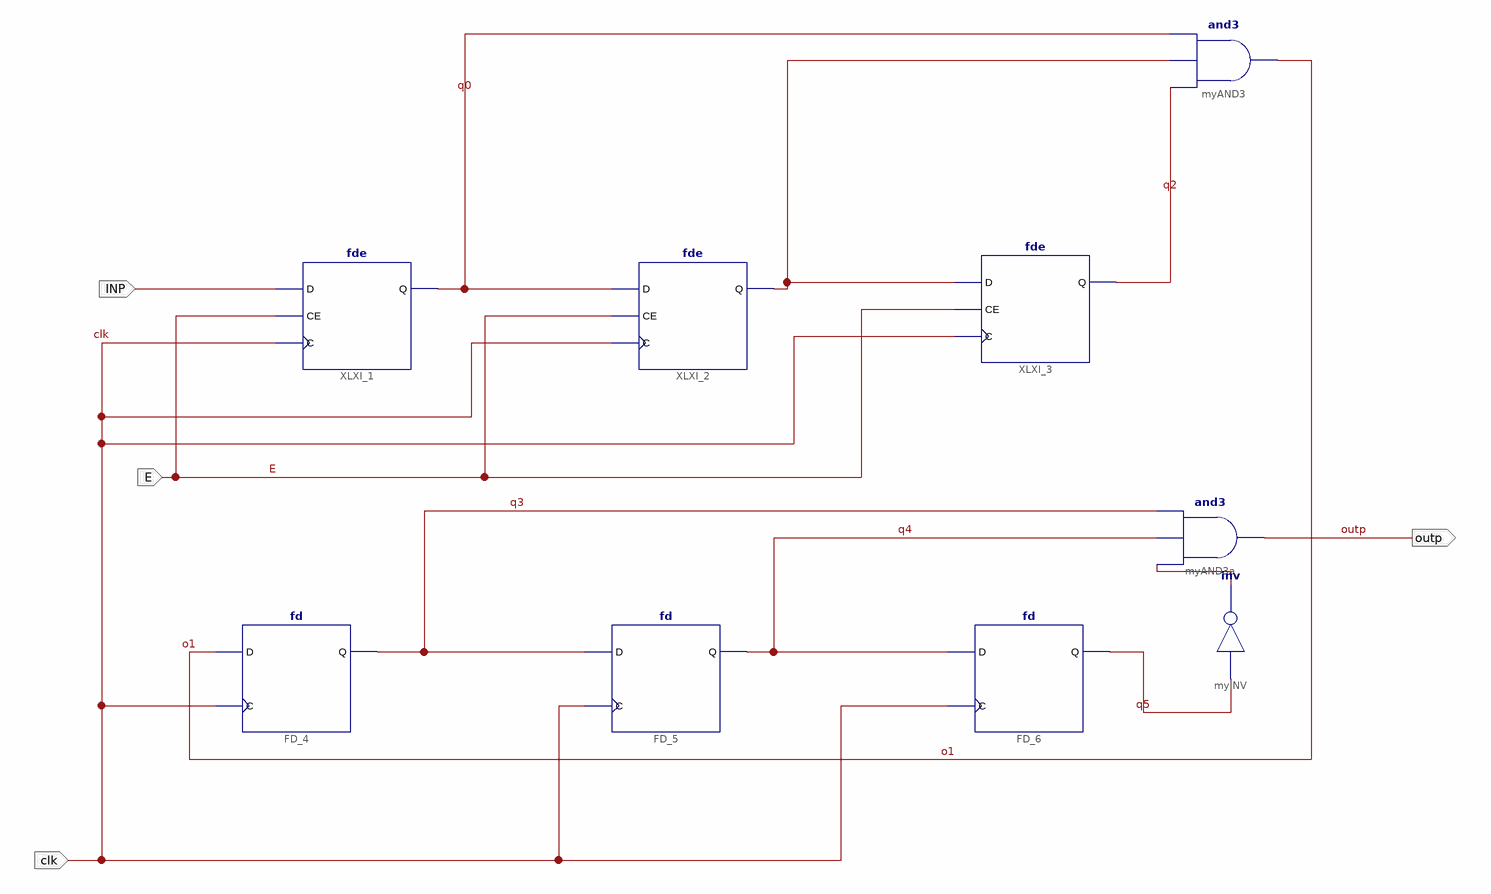
[diagram p0: schematic sheet 1]
// Xilinx ISE schematic pulse.sch (spartan6) as structural Verilog: 9 symbols, 4 ports
module pulse (
  input  E,
  input  INP,
  input  clk,
  output outp
);

  wire o1, q0, q1, q2, q3, q4, q5, XLXN_33;

  fde XLXI_1 (.C(clk), .CE(E), .D(INP), .Q(q0));
  fde XLXI_2 (.C(clk), .CE(E), .D(q0), .Q(q1));
  fde XLXI_3 (.C(clk), .CE(E), .D(q1), .Q(q2));
  fd FD_4 (.C(clk), .D(o1), .Q(q3));
  fd FD_5 (.C(clk), .D(q3), .Q(q4));
  fd FD_6 (.C(clk), .D(q4), .Q(q5));
  and myAND3 (o1, q2, q1, q0);
  and myAND3a (outp, XLXN_33, q4, q3);
  not myINV (XLXN_33, q5);
endmodule
